# Altium project Hospital_Ward_Management_System_Project_V1I1.PrjPcb (part 1 of 3)
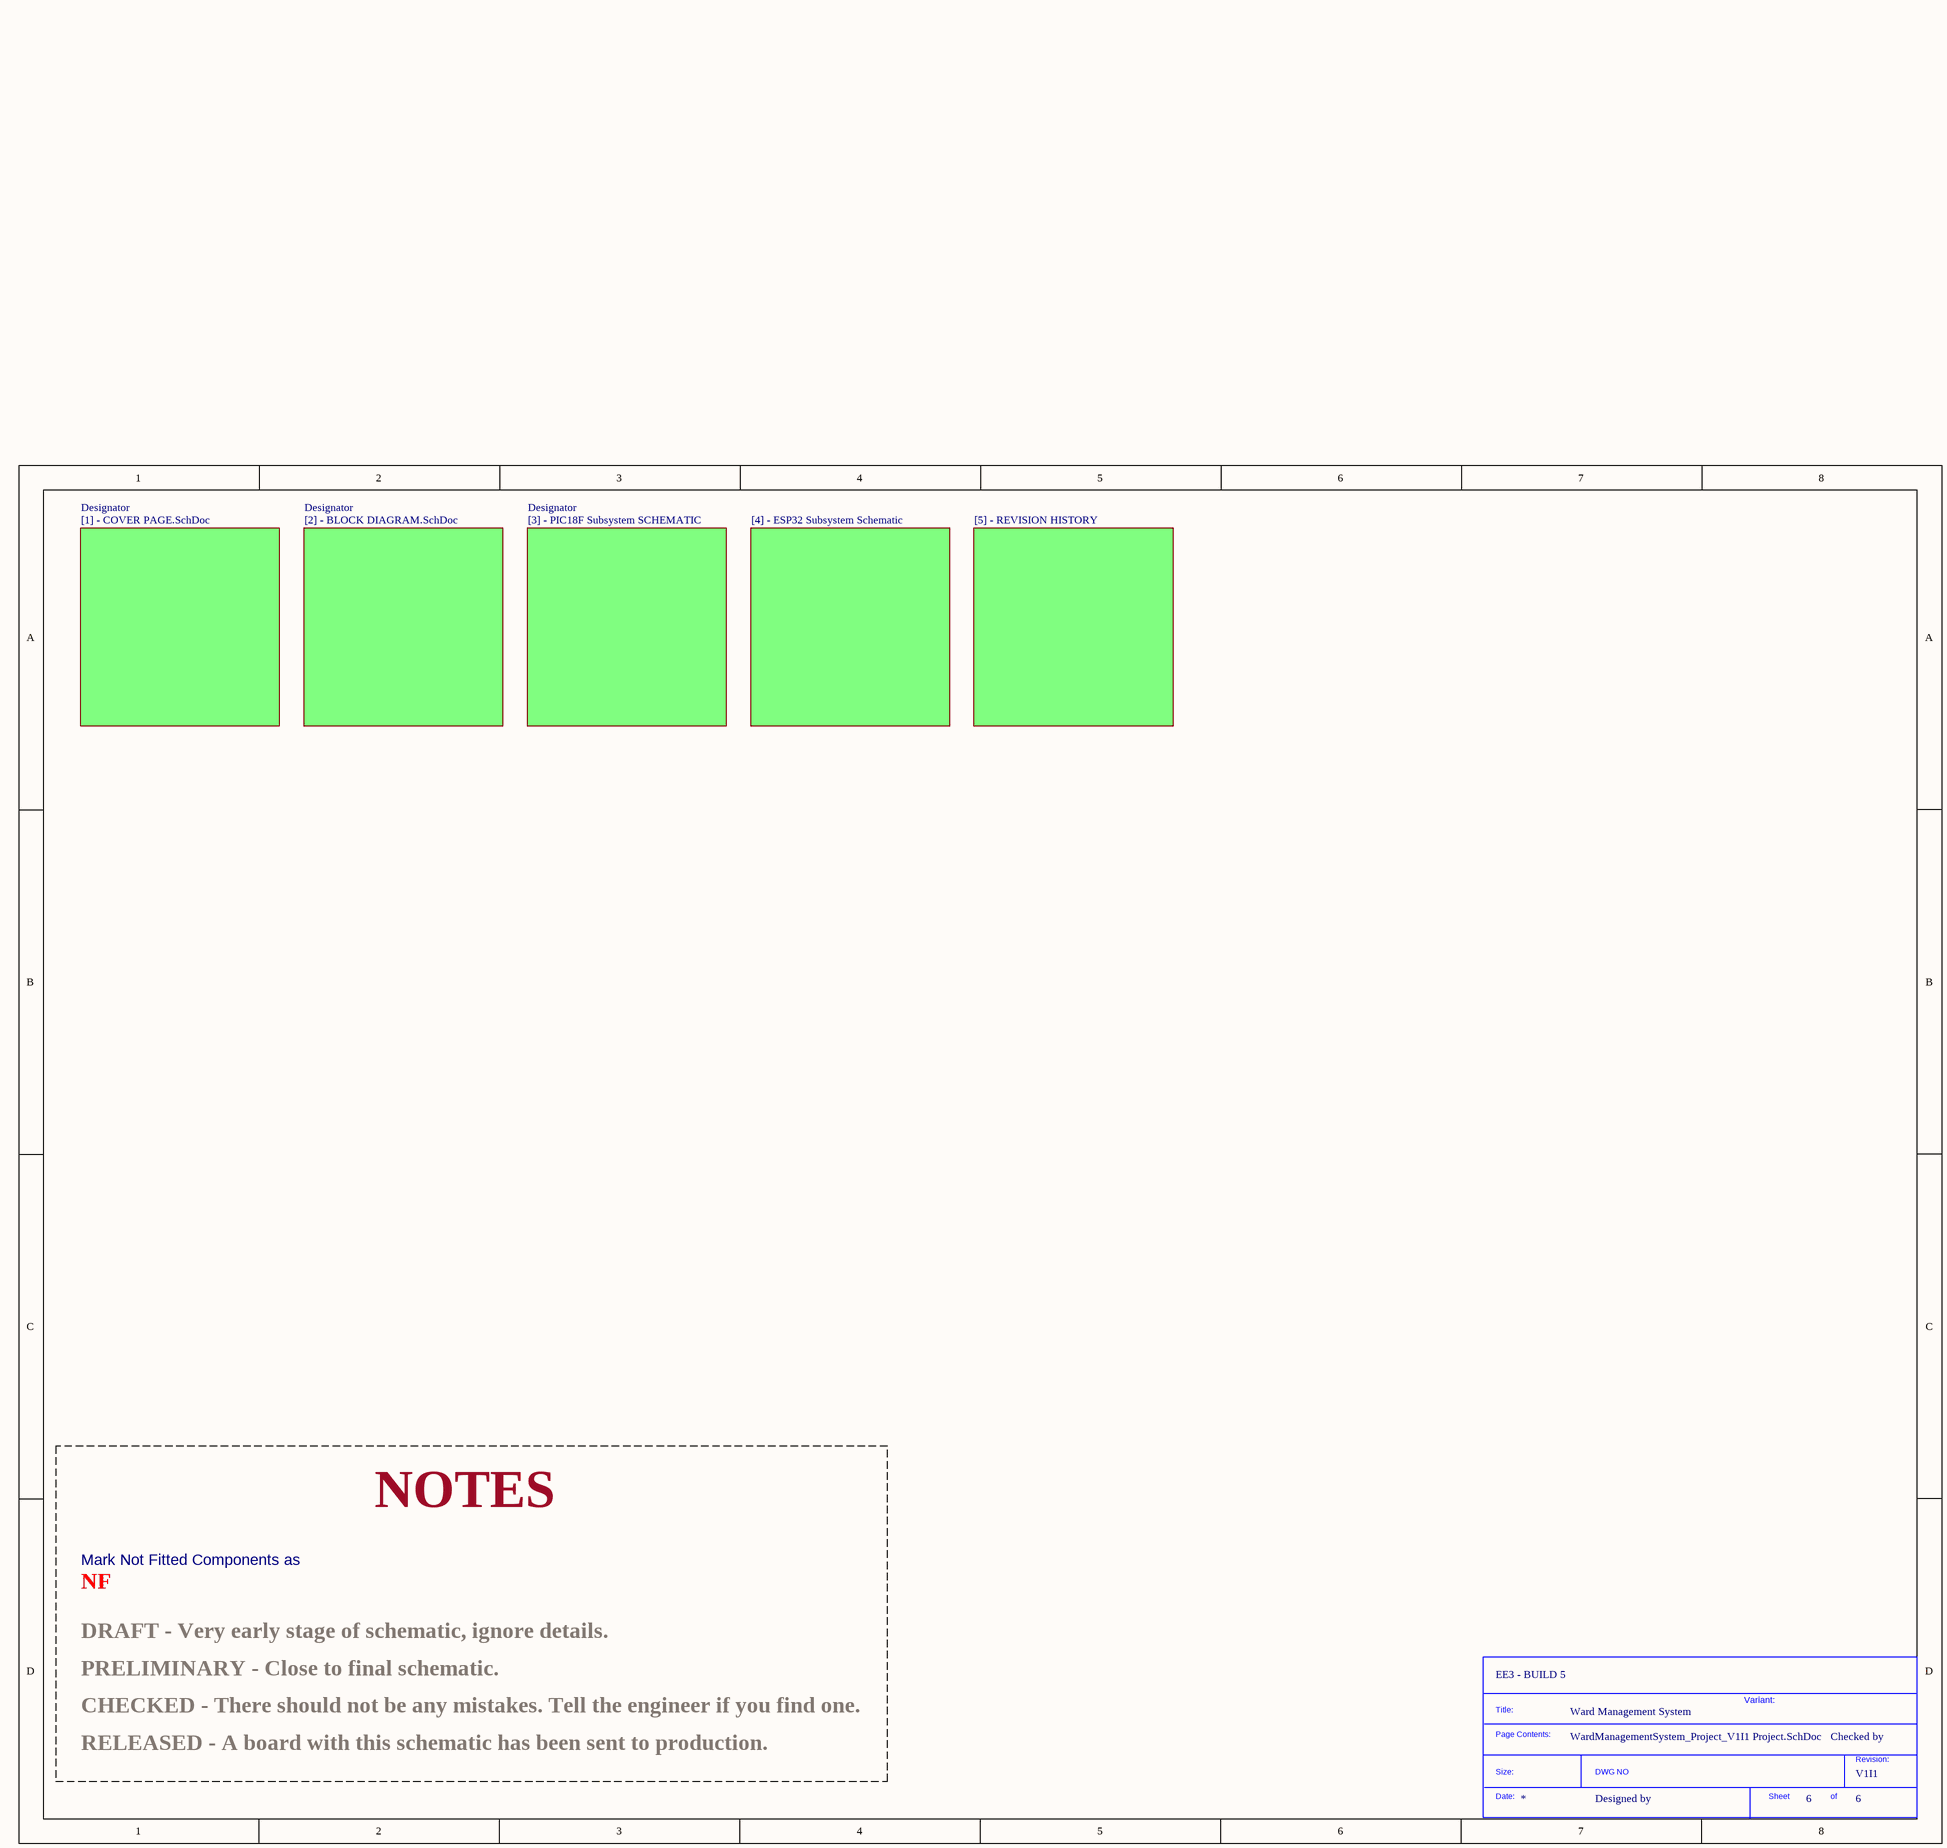
[diagram p0: WardManagementSystem_Project_V1I1 Project.SchDoc]
Company: EE3 - BUILD 5; Designer: Simeon Serafimov; NotFitted: NF; Project: Ward Management System; Validator: Simeon Serafimov; VersionRevision: V1I1
6 sheets, 81 parts. Net scope: global (net labels, ports and power ports of the same name join across sheets).
Board file: PIC18F_SUBSYSTEM_V1I1_PCB.PcbDoc
Sheets:
  WardManagementSystem_Project_V1I1 Project.SchDoc
    Designator = [1] - COVER PAGE.SchDoc
    Designator = [2] - BLOCK DIAGRAM.SchDoc
    Designator = [3] - PIC18F SUBSYSTEM SCHEMATIC.SchDoc
    Designator = [4] - ESP32 SUBSYSTEM SCHEMATIC.SchDoc
    Designator = [5] - REVISION HISTORY.SchDoc

## Sheet WardManagementSystem_Project_V1I1 Project.SchDoc
size A3; DocumentNumber: 6; SheetNumber: 6; SheetTotal: 6; PageSetup: Record=PageOptions|CenterHorizontal=True|CenterVertical=True|PrintScale=1.07|XCorrection=1.00|YCorrection=1.00|PrintKind=1|BorderSize=5000000|LeftOffset=0|BottomOffset=0|Orientation=2|PaperLength=1000|PaperWidth=1000|Scale=100|PaperSource=7|PrintQuality=600|MediaType=1|DitherType=10|PaperKind=A3|PrintScaleMode=1

### Parts
(Parts that share a designator on the sheet are numbered #1, #2 ... from top to bottom, then left to right.)
*#1  SDTitleBlock  (value not drawn)  (graphical)

### Sub-sheets
Designator = [1] - COVER PAGE.SchDoc: no entries
Designator = [2] - BLOCK DIAGRAM.SchDoc: no entries
Designator = [3] - PIC18F Subsystem SCHEMATIC: no entries
Designator = [4] - ESP32 Subsystem Schematic: no entries
Designator = [5] - REVISION HISTORY: no entries

### Notes on the sheet
- NOTES
- NF
- Mark Not Fitted Components as
- PRELIMINARY - Close to final schematic.
- DRAFT - Very early stage of schematic, ignore details.
- CHECKED - There should not be any mistakes. Tell the engineer if you find one.
- Variant:
- Checked by
- RELEASED - A board with this schematic has been sent to production.
- Designed by
- (in symbol SDTitleBlock) Title:; Page Contents:; Revision:; Size:; DWG NO; Date:; Sheet; of

## Sheet [1] - COVER PAGE.SchDoc
size A3; DocumentNumber: 1; SheetNumber: 1; SheetTotal: 6
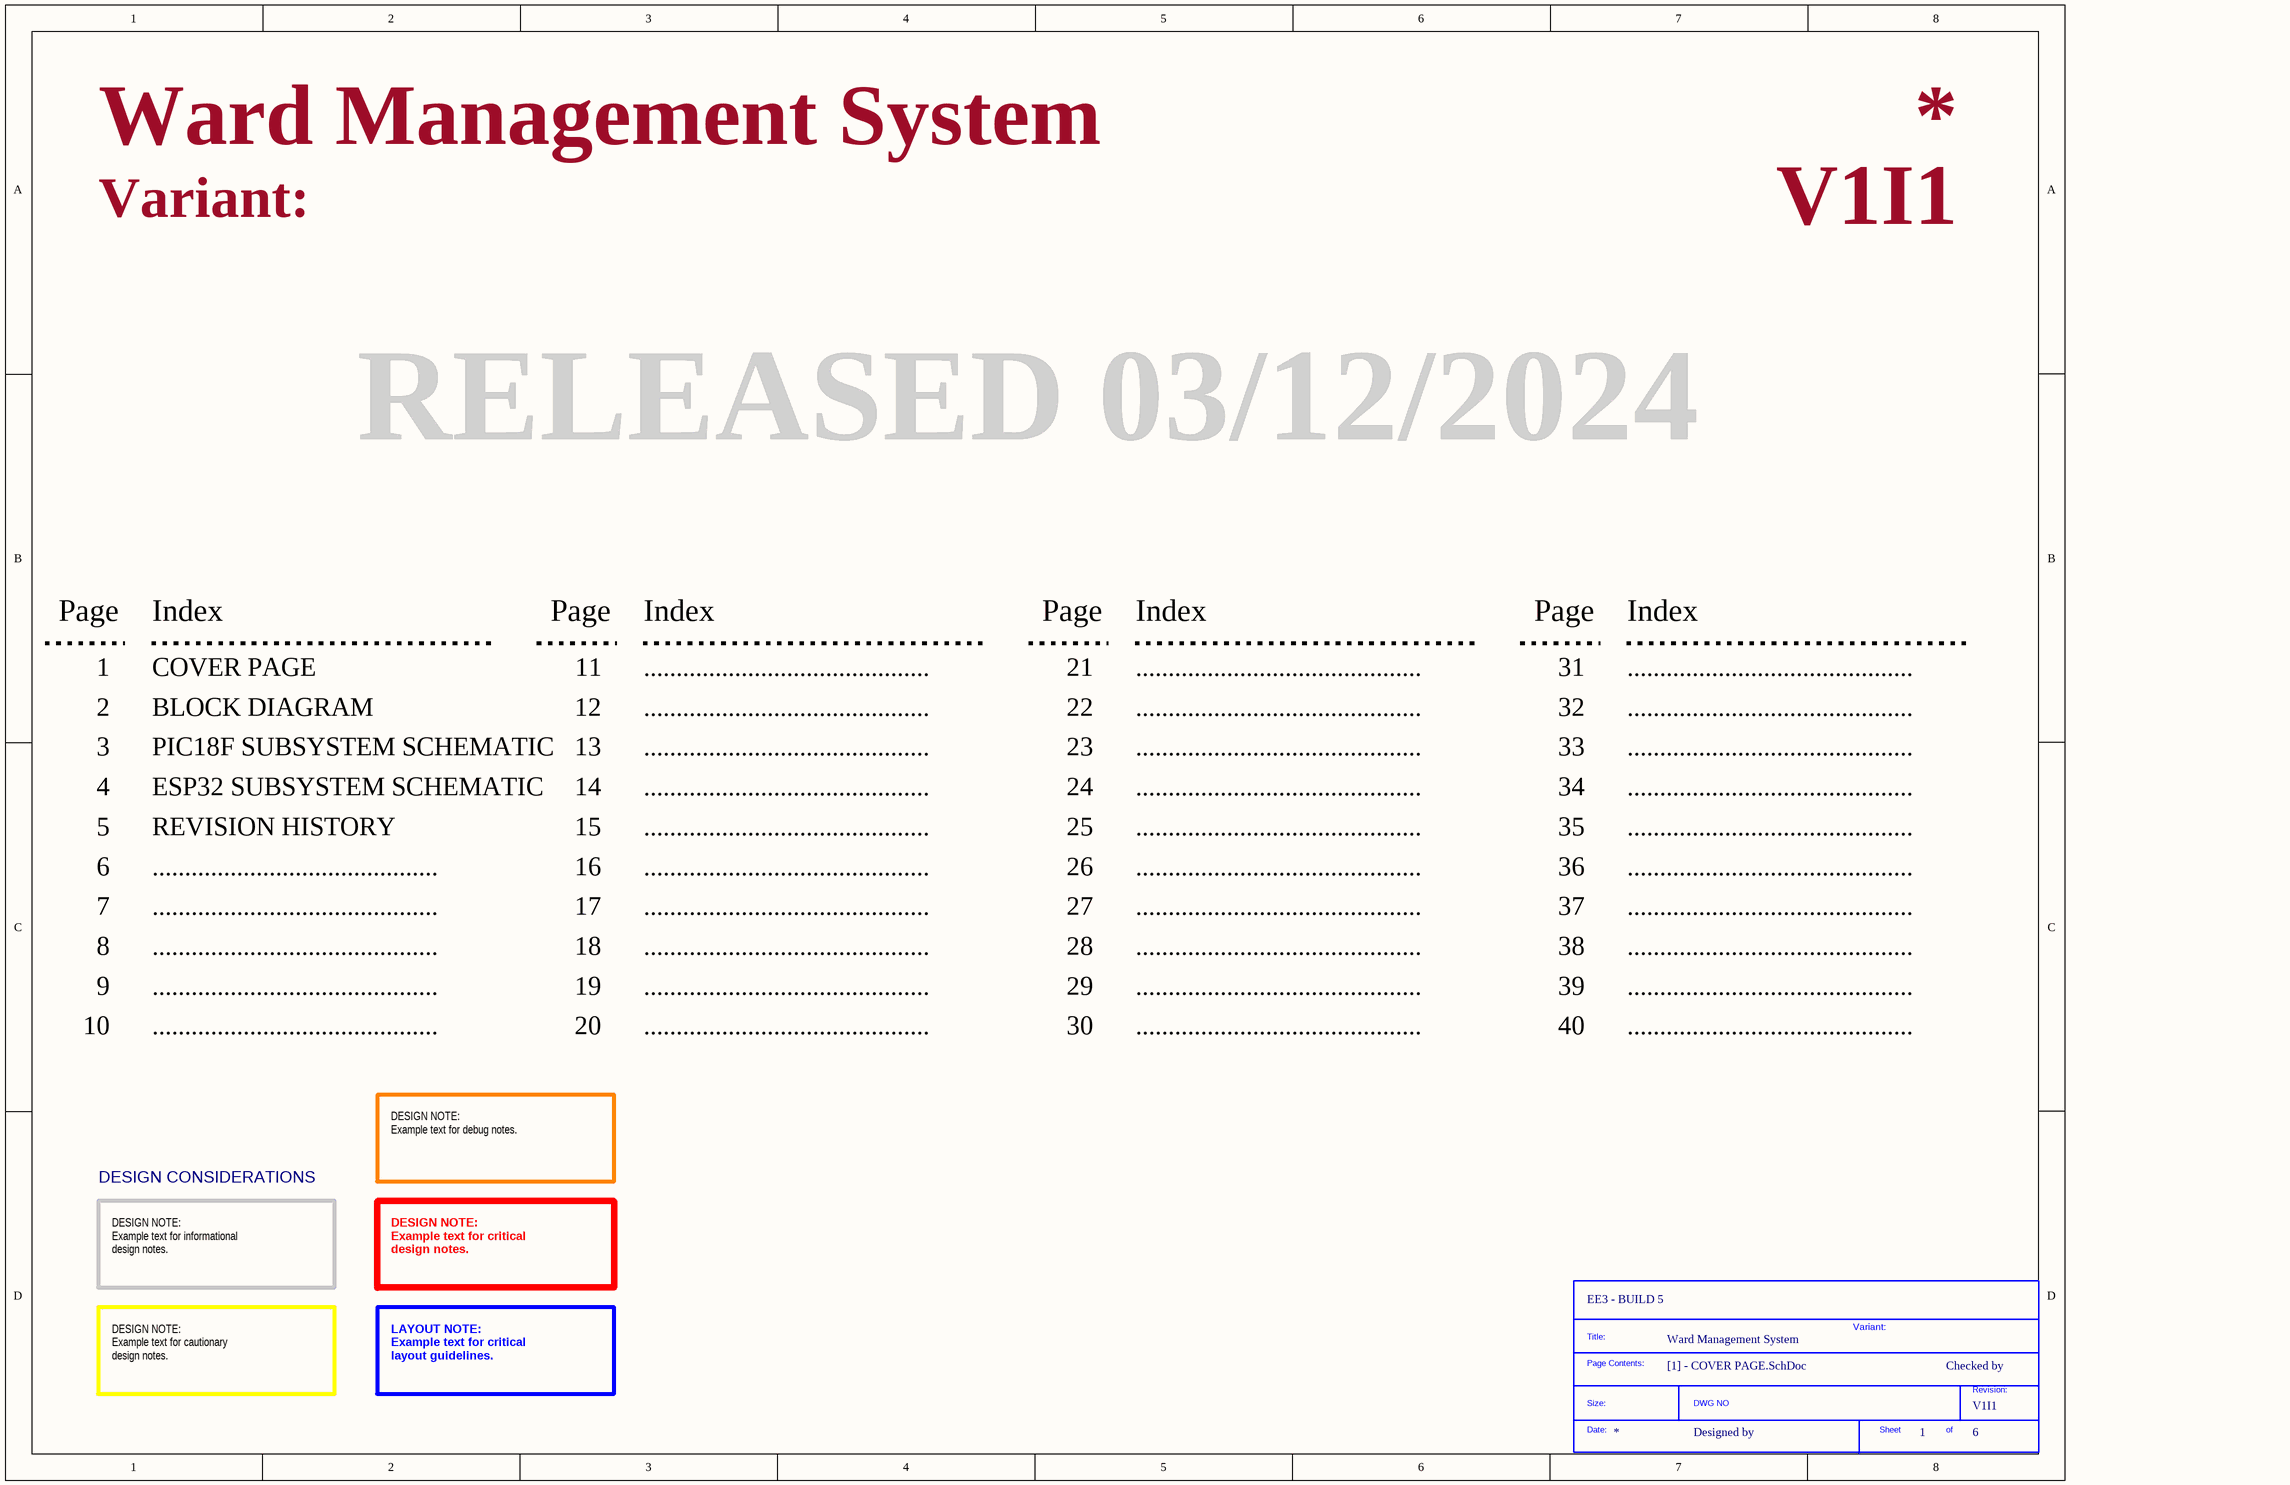
[diagram p1: [1] - COVER PAGE.SchDoc]

### Parts
(Parts that share a designator on the sheet are numbered #1, #2 ... from top to bottom, then left to right.)
*#2  SDTitleBlock  (value not drawn)  (graphical)

### Notes on the sheet
- Variant:
- RELEASED 03/12/2024
- Page
- Index
- 1
- COVER PAGE
- 11
- ............................................
- 21
- 31
- 2
- 3
- BLOCK DIAGRAM
- PIC18F SUBSYSTEM SCHEMATIC
- 12
- 13
- 22
- 23
- 32
- 33
- 4
- 5
- REVISION HISTORY
- ESP32 SUBSYSTEM SCHEMATIC
- 14
- 15
- 24
- 25
- 34
- 35
- 6
- 16
- 26
- 36
- 7
- 8
- 17
- 18
- 27
- 28
- 37
- 38
- 9
- 10
- 19
- 20
- 29
- 30
- 39
- 40
- DESIGN NOTE:
  Example text for debug notes.
- DESIGN CONSIDERATIONS
- DESIGN NOTE:
  Example text for informational
  design notes.
- DESIGN NOTE:
  Example text for critical
  design notes.
- Checked by
- DESIGN NOTE:
  Example text for cautionary
  design notes.
- LAYOUT NOTE:
  Example text for critical
  layout guidelines.
- Designed by
- (in symbol SDTitleBlock) Title:; Page Contents:; Revision:; Size:; DWG NO; Date:; Sheet; of

## Sheet [2] - BLOCK DIAGRAM.SchDoc
size A3; DocumentNumber: 2; SheetNumber: 2; SheetTotal: 6; PageSetup: Record=PageOptions|CenterHorizontal=True|CenterVertical=True|PrintScale=0.52|XCorrection=1.00|YCorrection=1.00|PrintKind=1|BorderSize=5000000|LeftOffset=0|BottomOffset=0|Orientation=2|PaperLength=1000|PaperWidth=1000|Scale=100|PaperSource=4|PrintQuality=600|MediaType=1|DitherType=10|PrintScaleMode=1|PaperKind=A4|PaperIndex=9
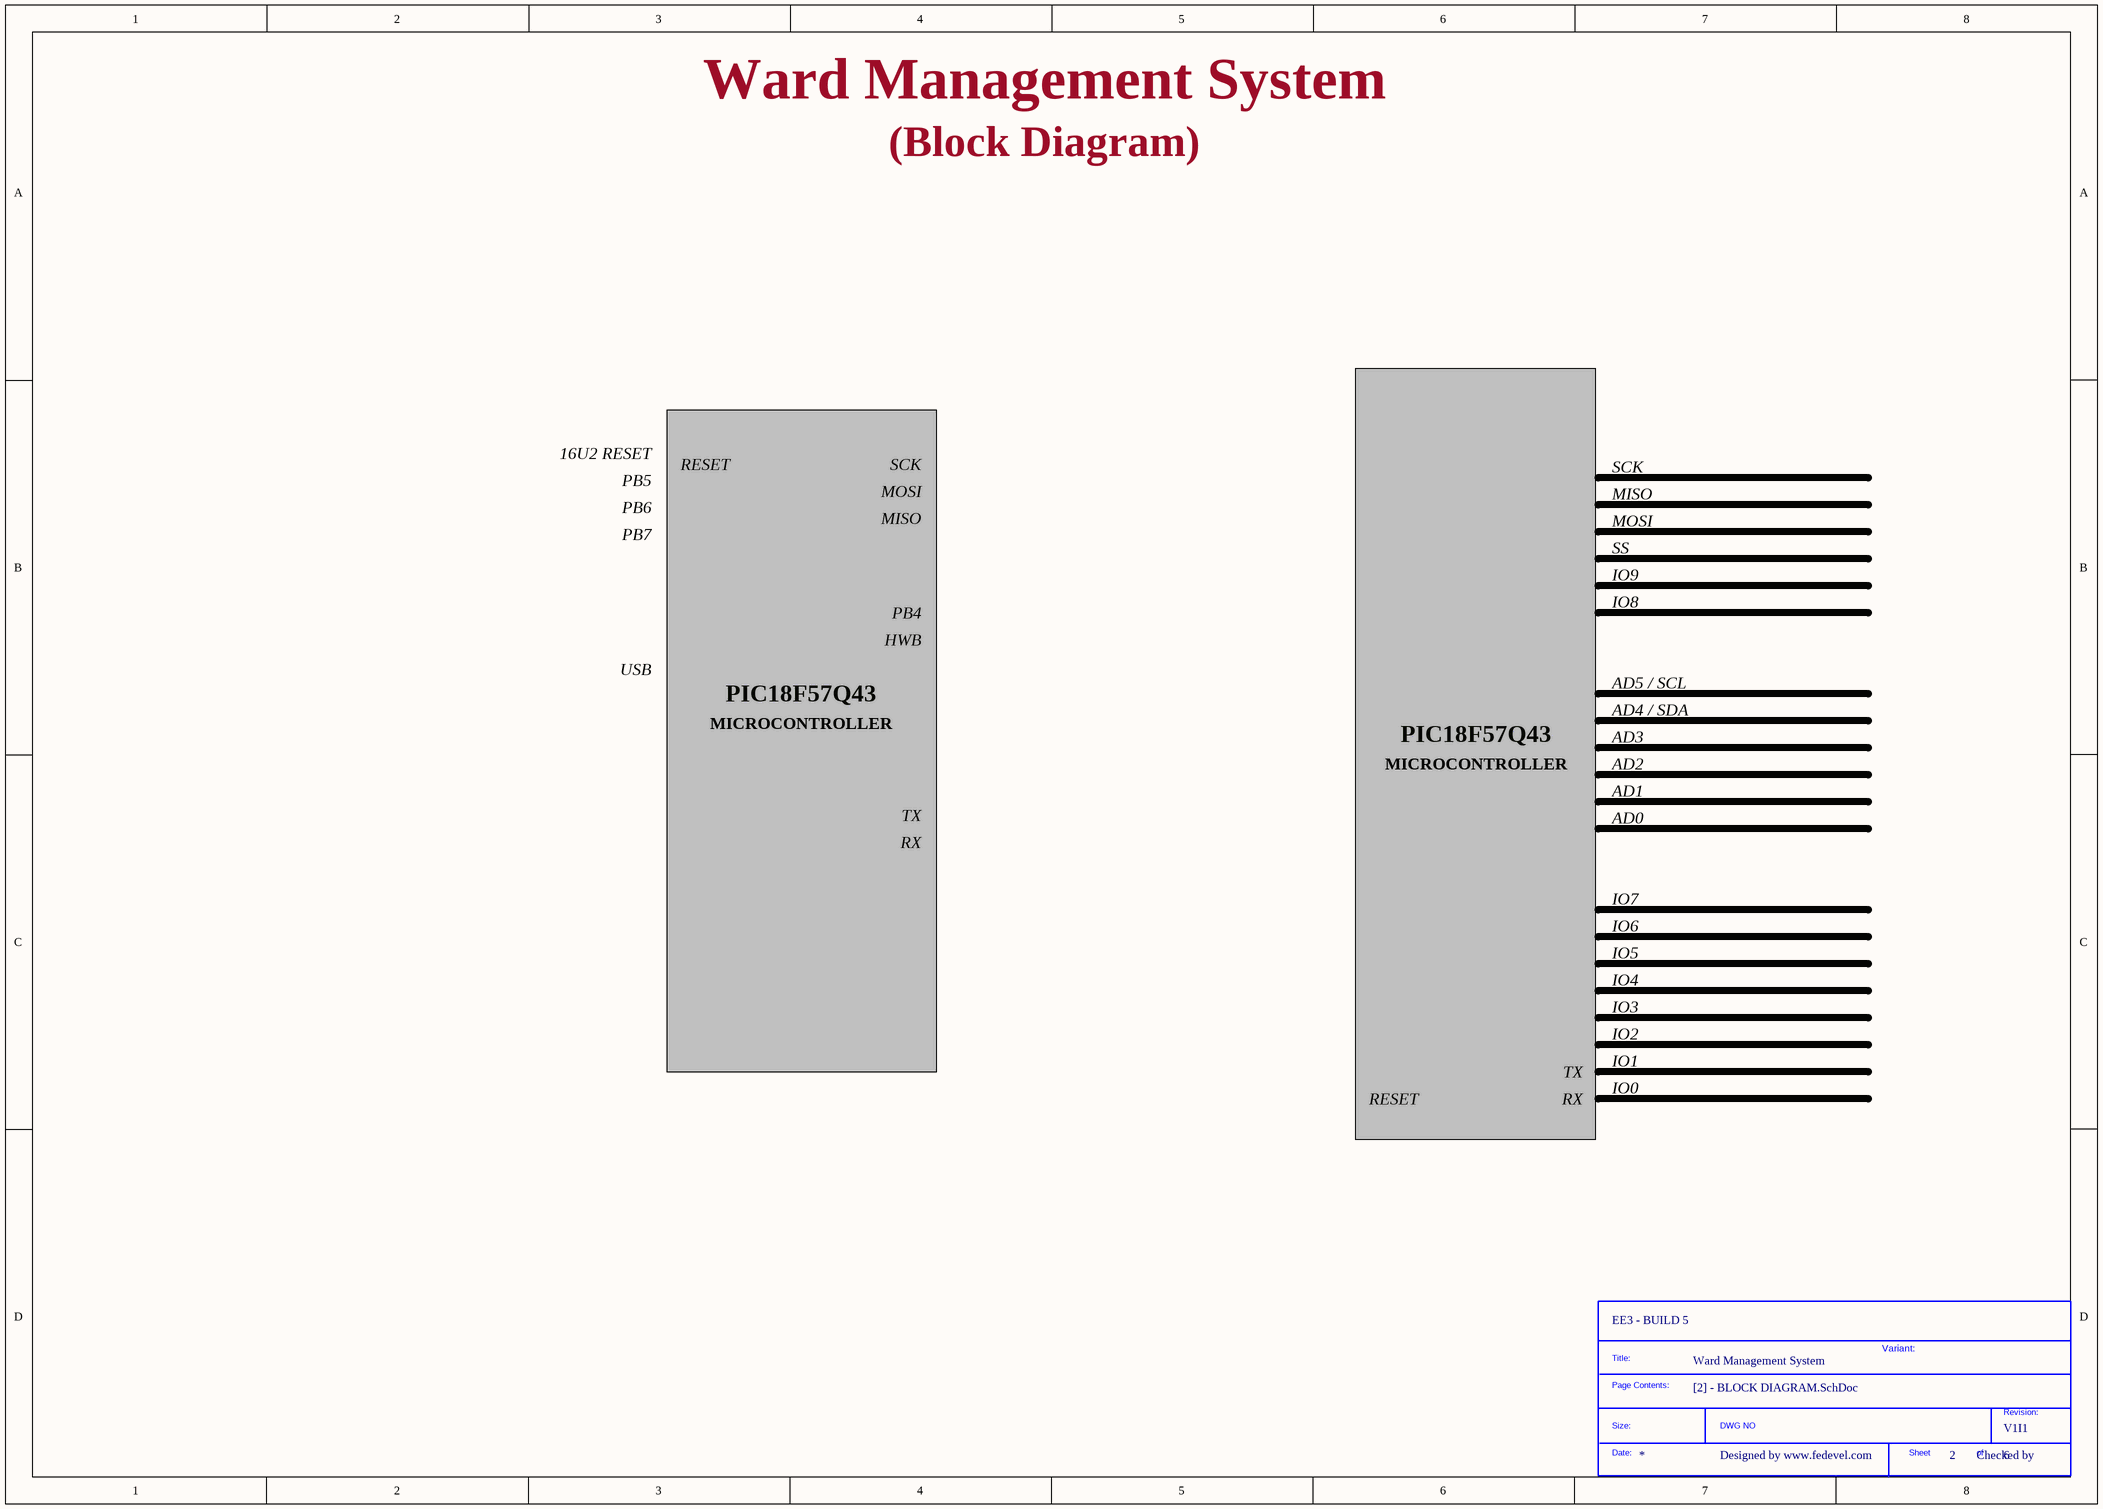
[diagram p2: [2] - BLOCK DIAGRAM.SchDoc]

### Parts
(Parts that share a designator on the sheet are numbered #1, #2 ... from top to bottom, then left to right.)
*#3  SDTitleBlock  (value not drawn)  (graphical)

### Notes on the sheet
- (Block Diagram)
- 16U2 RESET
- PB5
- PB6
- RESET
- MISO
- MOSI
- SCK
- PB7
- SS
- IO9
- PB4
- HWB
- IO8
- USB
- PIC18F57Q43
- AD5 / SCL
- AD4 / SDA
- MICROCONTROLLER
- AD3
- AD2
- RX
- TX
- AD1
- AD0
- IO7
- IO6
- IO5
- IO4
- IO3
- IO2
- IO1
- IO0
- Variant:
- Designed by www.fedevel.com
- Checked by
- (in symbol SDTitleBlock) Title:; Page Contents:; Revision:; Size:; DWG NO; Date:; Sheet; of

## Sheet [3] - PIC18F SUBSYSTEM SCHEMATIC.SchDoc
size A2; DocumentNumber: 3; SheetNumber: 3; SheetTotal: 6
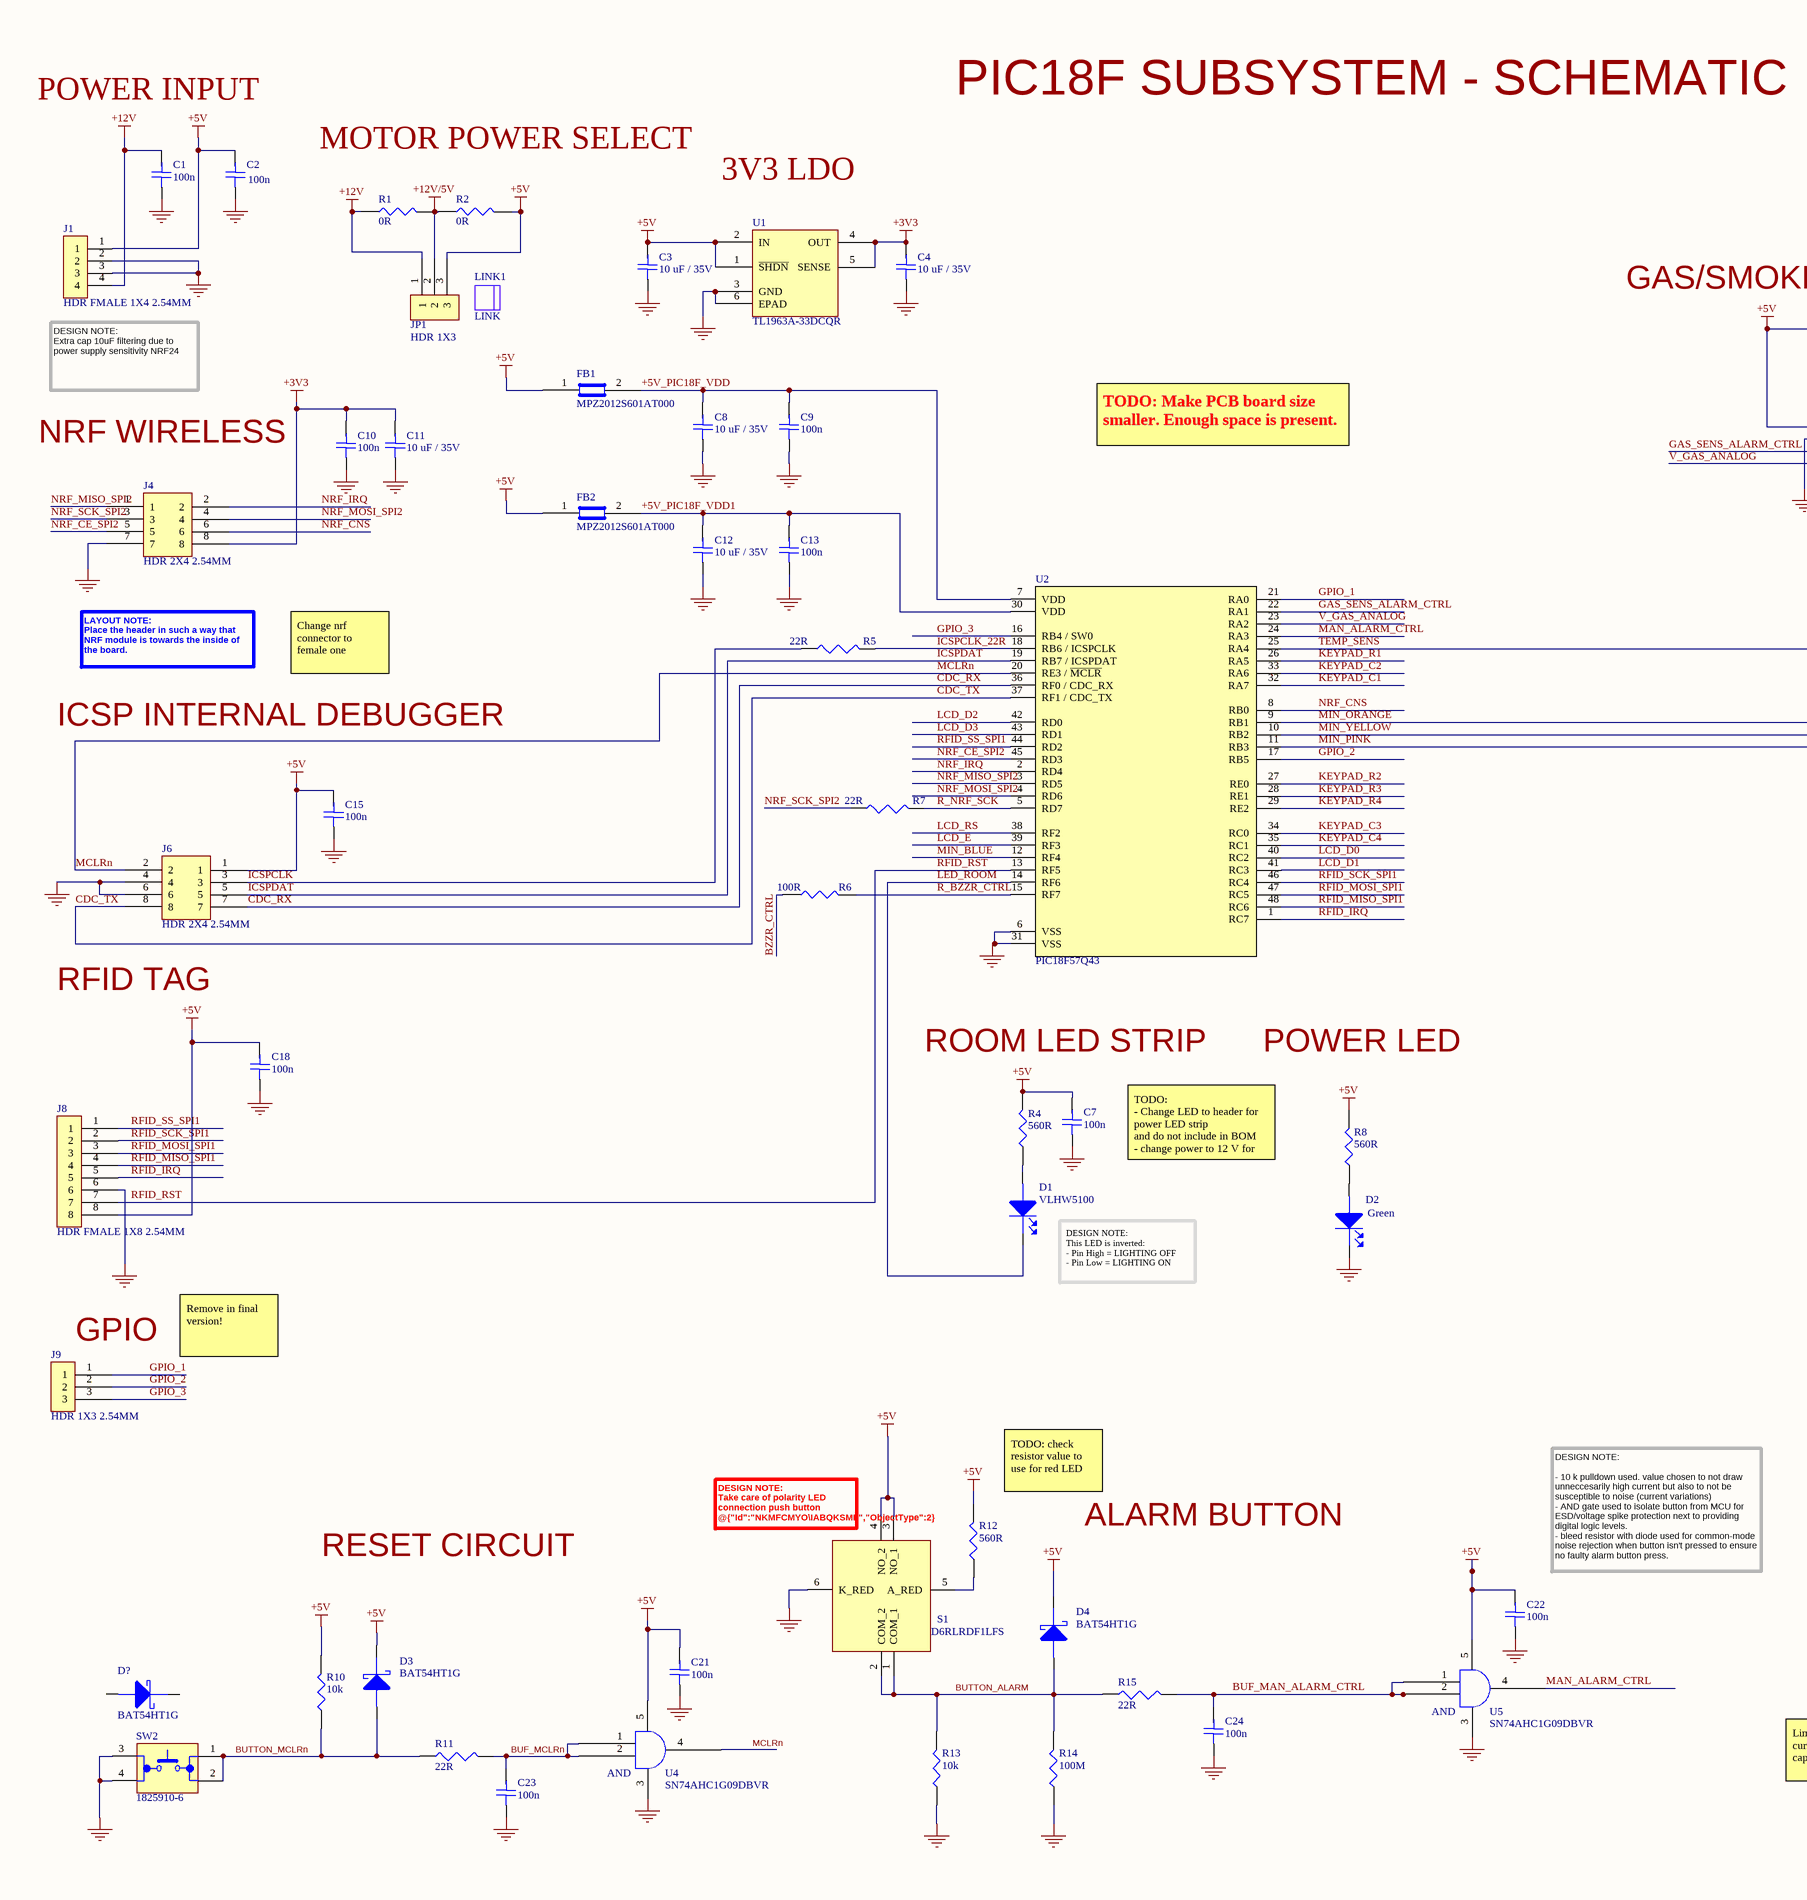
[diagram p3: [3] - PIC18F SUBSYSTEM SCHEMATIC.SchDoc, left]
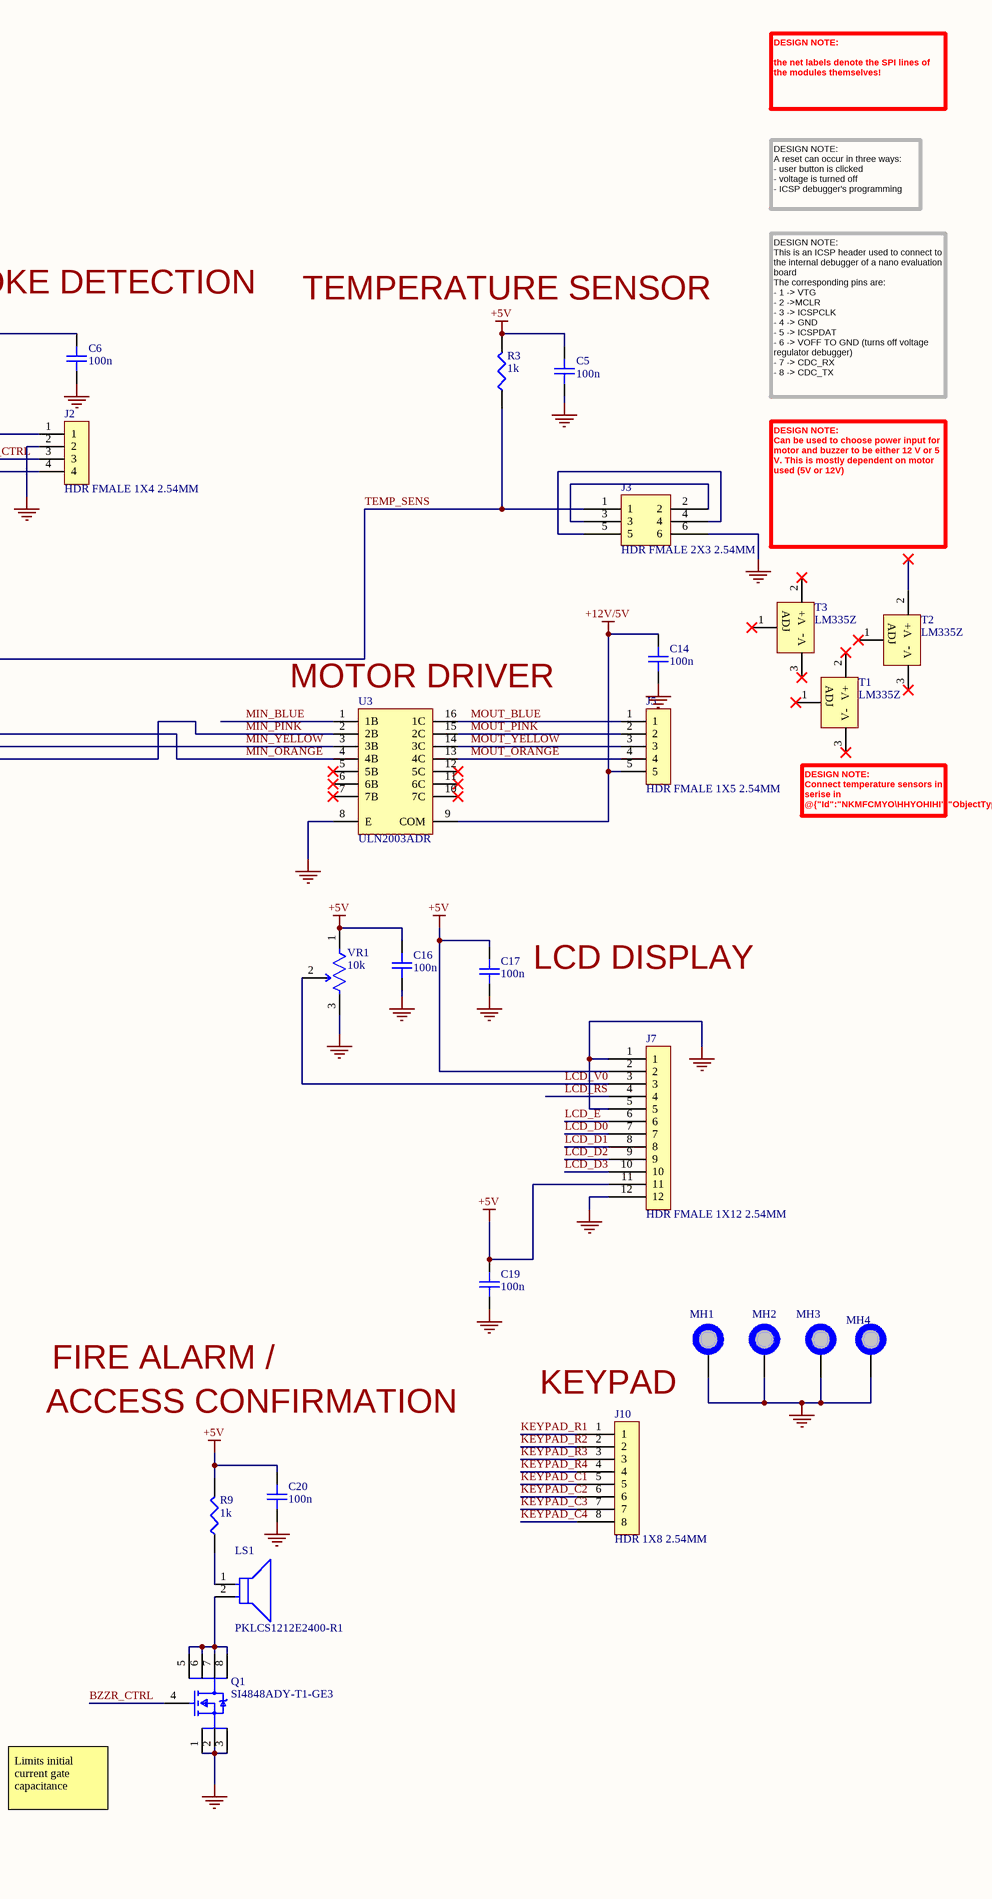
[diagram p4: [3] - PIC18F SUBSYSTEM SCHEMATIC.SchDoc, right]

### Parts
(Parts that share a designator on the sheet are numbered #1, #2 ... from top to bottom, then left to right.)
?#1  (no value)  (graphical)
C1  100n  [C0805]
C2  100n  [C0805]
C3  10 uF / 35V  [C0805]
C4  10 uF / 35V  [C0805]
C5  100n  [C0805]
C6  100n  [C0805]
C7  100n  [C0805]
C8  10 uF / 35V  [C0805]
C9  100n  [C0805]
C10  100n  [C0805]
C11  10 uF / 35V  [C0805]
C12  10 uF / 35V  [C0805]
C13  100n  [C0805]
C14  100n  [C0805]
C15  100n  [C0805]
C16  100n  [C0805]
C17  100n  [C0805]
C18  100n  [C0805]
C19  100n  [C0805]
C20  100n  [C0805]
C21  100n  [C0805]
C22  100n  [C0805]
C23  100n  [C0805]
C24  100n  [C0805]
D1  VLHW5100  [LED_VLHW5100]
D2  Green  [LED_0603]
D3  BAT54HT1G  [SOD323]
D4  BAT54HT1G  [SOD323]
D?  BAT54HT1G  [SOD323]
FB1  MPZ2012S601AT000  [C0805]
FB2  MPZ2012S601AT000  [C0805]
J1  HDR FMALE 1X4 2.54MM  [M20-7820442_Hdr_Female_1x4_2.54mm]
J2  HDR FMALE 1X4 2.54MM  [M20-7820442_Hdr_Female_1x4_2.54mm]
J3  HDR FMALE 2X3 2.54MM  [HDR_FEMALE_2X3_2.54MM]
J4  HDR 2X4 2.54MM  [HDR_2X4_2.54MM]
J5  HDR FMALE 1X5 2.54MM  [M20-7820542_Hdr_Female_1x5_2.54mm]
J6  HDR 2X4 2.54MM  [HDR_2X4_2.54MM]
J7  HDR FMALE 1X12 2.54MM  [Hdr_Female_1x12_2.54mm]
J8  HDR FMALE 1X8 2.54MM  [Hdr_Female_1x8_2.54mm]
J9  HDR 1X3 2.54MM  [HDR_1X3_2.54MM]
J10  HDR 1X8 2.54MM  [HDR_1X8_2.54MM]
JP1  HDR 1X3  [HDR_1X3_2.54MM]
LINK1  LINK  (mechanical)
LS1  PKLCS1212E2400-R1  [PKLCS1212E2000-R1]
MH1  MH_7.4MMC_3.2MMD  [MH_7.4MMD_3.2MMD]  (value not drawn)  (no BOM)
MH2  MH_7.4MMC_3.2MMD  [MH_7.4MMD_3.2MMD]  (value not drawn)  (no BOM)
MH3  MH_7.4MMC_3.2MMD  [MH_7.4MMD_3.2MMD]  (value not drawn)  (no BOM)
MH4  MH_7.4MMC_3.2MMD  [MH_7.4MMD_3.2MMD]  (value not drawn)  (no BOM)
Q1  SI4848ADY-T1-GE3  [SO-8-IPC_A]
R1  0R  [R0805]
R2  0R  [R0805]
R3  1k  [R0805]
R4  560R  [R0805]
R5  22R  [R0805]
R6  100R  [R0805]
R7  22R  [R0805]
R8  560R  [R0805]
R9  1k  [R0805]
R10  10k  [R0805]
R11  22R  [R0805]
R12  560R  [R0805]
R13  10k  [R0805]
R14  100M  [R0805]
R15  22R  [R0805]
S1  D6RLRDF1LFS  [D6RLRDF1LFS]
SW2  1825910-6  [1825910-6]
T1  LM335Z  [Z03A]  (mechanical)
T2  LM335Z  [Z03A]  (mechanical)
T3  LM335Z  [Z03A]  (mechanical)
U1  TL1963A-33DCQR  [DCQ (R-PDSO-G6)]
U2  PIC18F57Q43  [TQFP48_YX8]  (no BOM)
U3  ULN2003ADR  [SOIC16]
U4  SN74AHC1G09DBVR  [DBV_SOT_23_5]
U5  SN74AHC1G09DBVR  [DBV_SOT_23_5]
VR1  10k  [3361P]

### Nets
+3V3: C4.2 C10.2 C11.2 J4.8 U1.4(OUT) U1.5(SENSE)
+5V: C2.2 C3.2 C5.2 C6.2 C7.2 C15.2 C16.2 C17.2 C18.2 C19.2 C20.2 C21.2 C22.2 D3.1(Cathode) D4.1(Cathode) FB1.1 FB2.1 J1.1 J2.1 J6.1 J7.2 J7.11 J8.8 JP1.3 R2.2 R3.2 R4.2 R8.2 R9.2 R10.2 R12.2 S1.3(NO_1) S1.4(NO_2) U1.1(~{SHDN}) U1.2(IN) U4.5 U5.5 VR1.1(CCW)
+12V: C1.2 J1.4 JP1.1 R1.1
+12V/5V: C14.2 J5.5 JP1.2 R1.2 R2.1 U3.9(COM)
GND: C1.1 C2.1 C3.1 C4.1 C5.1 C6.1 C7.1 C8.1 C9.1 C10.1 C11.1 C12.1 C13.1 C14.1 C15.1 C16.1 C17.1 C18.1 C19.1 C20.1 C21.1 C22.1 C23.1 C24.1 D2.1(Cathode) J1.2 J1.3 J2.2 J3.6 J4.7 J6.4 J6.6 J7.1 J7.5 J7.12 J8.6 MH1.1 MH2.1 MH3.1 MH4.1 Q1.1(S) Q1.2(S) Q1.3(S) R13.1 R14.1 S1.6(K_RED) SW2.3 SW2.4 U1.3(GND) U1.6(EPAD) U2.6(VSS) U2.31(VSS) U3.8(E) U4.3 U5.3 VR1.3(CW)
+5V_PIC18F_VDD: C8.2 C9.2 FB1.2 U2.7(VDD)
+5V_PIC18F_VDD1: C12.2 C13.2 FB2.2 U2.30(VDD)
BUF_MAN_ALARM_CTRL: C24.2 R15.2 U5.1 U5.2
BUF_MCLRn: C23.2 R11.2 U4.1 U4.2
BUTTON_ALARM: D4.2(Anode) R13.2 R14.2 R15.1 S1.1(COM_1) S1.2(COM_2)
BUTTON_MCLRn: D3.2(Anode) R10.1 R11.1 SW2.1 SW2.2
BZZR_CTRL: Q1.4(G) R6.1
CDC_RX: J6.7 U2.36(RF0_/_CDC_RX)
CDC_TX: J6.8 U2.37(RF1_/_CDC_TX)
GAS_SENS_ALARM_CTRL: J2.3 U2.22(RA1)
GPIO_1: J9.1 U2.21(RA0)
GPIO_2: J9.2 U2.17(RB5)
GPIO_3: J9.3 U2.16(RB4_/_SW0)
ICSPCLK: J6.3 R5.1
ICSPCLK_22R: R5.2 U2.18(RB6_/_ICSPCLK)
ICSPDAT: J6.5 U2.19(RB7_/_ICSPDAT)
KEYPAD_C1: J10.5 U2.32(RA7)
KEYPAD_C2: J10.6 U2.33(RA6)
KEYPAD_C3: J10.7 U2.34(RC0)
KEYPAD_C4: J10.8 U2.35(RC1)
KEYPAD_R1: J10.1 U2.26(RA5)
KEYPAD_R2: J10.2 U2.27(RE0)
KEYPAD_R3: J10.3 U2.28(RE1)
KEYPAD_R4: J10.4 U2.29(RE2)
LCD_D0: J7.7 U2.40(RC2)
LCD_D1: J7.8 U2.41(RC3)
LCD_D2: J7.9 U2.42(RD0)
LCD_D3: J7.10 U2.43(RD1)
LCD_E: J7.6 U2.39(RF3)
LCD_RS: J7.4 U2.38(RF2)
LCD_V0: J7.3 VR1.2(WIPER)
LED_ROOM: D1.1(Cathode) U2.14(RF6)
MAN_ALARM_CTRL: U2.24(RA3) U5.4
MCLRn: J6.2 U2.20(RE3_/_~{MCLR}) U4.4
MIN_BLUE: U2.12(RF4) U3.1(1B)
MIN_ORANGE: U2.9(RB1) U3.4(4B)
MIN_PINK: U2.11(RB3) U3.2(2B)
MIN_YELLOW: U2.10(RB2) U3.3(3B)
MOUT_BLUE: J5.1 U3.16(1C)
MOUT_ORANGE: J5.4 U3.13(4C)
MOUT_PINK: J5.2 U3.15(2C)
MOUT_YELLOW: J5.3 U3.14(3C)
NRF_CE_SPI2: J4.5 U2.45(RD3)
NRF_CNS: J4.6 U2.8(RB0)
NRF_IRQ: J4.2 U2.2(RD4)
NRF_MISO_SPI2: J4.1 U2.3(RD5)
NRF_MOSI_SPI2: J4.4 U2.4(RD6)
NRF_SCK_SPI2: J4.3 R7.1
R_BZZR_CTRL: R6.2 U2.15(RF7)
R_NRF_SCK: R7.2 U2.5(RD7)
RFID_IRQ: J8.5 U2.1(RC7)
RFID_MISO_SPI1: J8.4 U2.48(RC6)
RFID_MOSI_SPI1: J8.3 U2.47(RC5)
RFID_RST: J8.7 U2.13(RF5)
RFID_SCK_SPI1: J8.2 U2.46(RC4)
RFID_SS_SPI1: J8.1 U2.44(RD2)
TEMP_SENS: J3.1 R3.1 U2.25(RA4)
V_GAS_ANALOG: J2.4 U2.23(RA2)
NetD1_2: D1.2(Anode) R4.1
NetD2_2: D2.2(Anode) R8.1
NetJ3_2: J3.2 J3.3
NetJ3_4: J3.4 J3.5
NetLS1_1: LS1.1(C) R9.1
NetLS1_2: LS1.2(A) Q1.5(D) Q1.6(D) Q1.7(D) Q1.8(D)
NetR12_1: R12.1 S1.5(A_RED)

Not connected (* = marked no-connect by the designer): D? 1(Cathode) 2(Anode); T1 1(ADJ)* 2(V+)* 3(V-)*; T2 1(ADJ)* 2(V+)* 3(V-)*; T3 1(ADJ)* 2(V+)* 3(V-)*; U3 5(5B)* 6(6B)* 7(7B)* 10(7C)* 11(6C)* 12(5C)*

### Notes on the sheet
- POWER INPUT
- MOTOR POWER SELECT
- PIC18F SUBSYSTEM - SCHEMATIC
- DESIGN NOTE:
  the net labels denote the SPI lines of the modules themselves!
- 3V3 LDO
- DESIGN NOTE:
  A reset can occur in three ways:
  - user button is clicked
  - voltage is turned off
  - ICSP debugger's programming
- (near C6) GAS/SMOKE DETECTION
- TEMPERATURE SENSOR
- (near J1) DESIGN NOTE:
  Extra cap 10uF filtering due to power supply sensitivity NRF24
- DESIGN NOTE:
  This is an ICSP header used to connect to the internal debugger of a nano evaluation board
  The corresponding pins are:
  - 1 -> VTG
  - 2 ->MCLR
  - 3 -> ICSPCLK
  - 4 -> GND
  - 5 -> ICSPDAT
  - 6 -> VOFF TO GND (turns off voltage regulator debugger)
  - 7 -> CDC_RX
  - 8 -> CDC_TX
- NRF WIRELESS
- TODO: Make PCB board size smaller. Enough space is present.
- DESIGN NOTE:
  Can be used to choose power input for motor and buzzer to be either 12 V or 5 V. This is mostly dependent on motor used (5V or 12V)
- LAYOUT NOTE:
  Place the header in such a way that NRF module is towards the inside of the board.
- Change nrf connector to female one
- (near U3) MOTOR DRIVER
- ICSP INTERNAL DEBUGGER
- (near T1) DESIGN NOTE:
  Connect temperature sensors in serise in @{"Id":"NKMFCMYO\HHYOHIHI","ObjectType":2}
- RFID TAG
- (near C17) LCD DISPLAY
- ROOM LED STRIP
- POWER LED
- TODO:
  - Change LED to header for power LED strip
  and do not include in BOM
  - change power to 12 V for LED strip in V2.
- (near D1) DESIGN NOTE:
  This LED is inverted:
  - Pin High = LIGHTING OFF
  - Pin Low = LIGHTING ON
- (near J9) GPIO
- Remove in final version!
- FIRE ALARM /
- ACCESS CONFIRMATION
- (near J10) KEYPAD
- (near R12) TODO: check resistor value to use for red LED
- RESET CIRCUIT
- (near S1) DESIGN NOTE:
  Take care of polarity LED connection push button @{"Id":"NKMFCMYO\IABQKSML","ObjectType":2}
- ALARM BUTTON
- (near C22) DESIGN NOTE:
  - 10 k pulldown used. value chosen to not draw unneccesarily high current but also to not be susceptible to noise (current variations)
  - AND gate used to isolate button from MCU for ESD/voltage spike protection next to providing digital logic levels.
  - bleed resistor with diode used for common-mode noise rejection when button isn't pressed to ensure no faulty alarm button press.
- Limits initial current gate capacitance
- Title:
- Page Contents:
- Variant:
- Checked by
- Size:
- Date:
- DWG NO
- Designed by
- Sheet
- of
- Revision:
- (in symbol SN74AHC1G09DBVR) AND